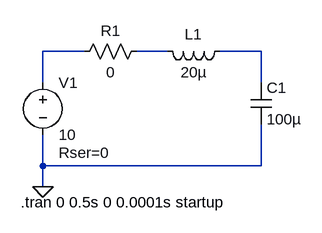
[diagram p0: schematic Draft2.asc]
Draft2.asc, the LTspice schematic file:
Version 4
SHEET 1 880 680
WIRE 48 112 -16 112
WIRE 176 112 128 112
WIRE 320 112 256 112
WIRE -16 160 -16 112
WIRE 320 160 320 112
WIRE -16 288 -16 240
WIRE 320 288 320 224
WIRE 320 288 -16 288
WIRE -16 320 -16 288
FLAG -16 320 0
SYMBOL cap 304 160 R0
SYMATTR InstName C1
SYMATTR Value 100µ
SYMBOL ind 272 96 R90
WINDOW 0 5 56 VBottom 2
WINDOW 3 32 56 VTop 2
SYMATTR InstName L1
SYMATTR Value 20µ
SYMATTR SpiceLine Ipk=1.5 Rser=0 Rpar=0 Cpar=0
SYMBOL res 144 96 R90
WINDOW 0 0 56 VBottom 2
WINDOW 3 32 56 VTop 2
SYMATTR InstName R1
SYMATTR Value 0
SYMBOL voltage -16 144 R0
WINDOW 123 0 0 Left 2
WINDOW 39 24 124 Left 2
SYMATTR InstName V1
SYMATTR Value 10
SYMATTR SpiceLine Rser=0
TEXT -50 344 Left 2 !.tran 0 0.5s 0 0.0001s startup

The netlist it stands for:
* Draft2.asc
C1 N003 0 100µ
L1 N003 N002 20µ Ipk=1.5 Rser=0 Rpar=0 Cpar=0
R1 N002 N001 0
V1 N001 0 10 Rser=0
.tran 0 0.5s 0 0.0001s startup
.backanno
.end